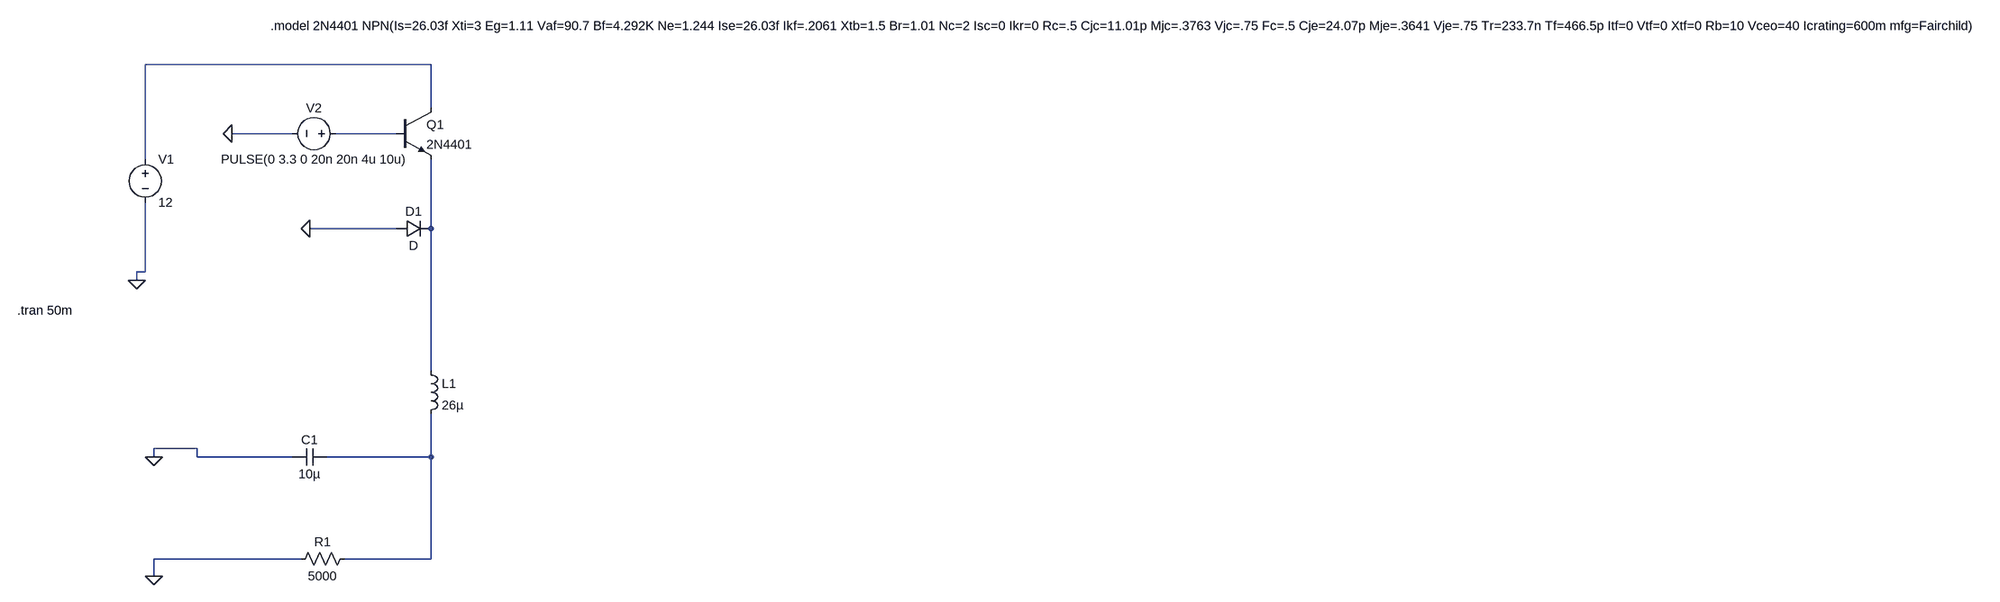
[diagram p0: schematic Buck convertor 12v to 2_2.asc]
Buck convertor 12v to 2_2.asc, the LTspice schematic file:
Version 4
SHEET 1 3708 1124
WIRE 480 144 -48 144
WIRE 480 224 480 144
WIRE 224 272 112 272
WIRE 416 272 304 272
WIRE -48 320 -48 144
WIRE 416 448 256 448
WIRE 480 448 480 320
WIRE -48 528 -48 400
WIRE -48 528 -64 528
WIRE -64 544 -64 528
WIRE 480 720 480 448
WIRE 48 864 -32 864
WIRE -32 880 -32 864
WIRE 48 880 48 864
WIRE 224 880 48 880
WIRE 480 880 480 800
WIRE 480 880 288 880
WIRE 240 1072 -32 1072
WIRE 480 1072 480 880
WIRE 480 1072 320 1072
WIRE -32 1104 -32 1072
FLAG 256 448 0
FLAG -64 544 0
FLAG -32 880 0
FLAG -32 1104 0
FLAG 112 272 0
SYMBOL npn 416 224 R0
SYMATTR InstName Q1
SYMATTR Value 2N4401
SYMBOL voltage -48 304 R0
SYMATTR InstName V1
SYMATTR Value 12
SYMBOL diode 416 464 R270
WINDOW 0 32 32 VTop 2
WINDOW 3 0 32 VBottom 2
SYMATTR InstName D1
SYMBOL ind 464 704 R0
SYMATTR InstName L1
SYMATTR Value 26µ
SYMBOL cap 288 864 R90
WINDOW 0 0 32 VBottom 2
WINDOW 3 32 32 VTop 2
SYMATTR InstName C1
SYMATTR Value 10µ
SYMBOL res 336 1056 R90
WINDOW 0 0 56 VBottom 2
WINDOW 3 32 56 VTop 2
SYMATTR InstName R1
SYMATTR Value 5000
SYMBOL voltage 320 272 R90
WINDOW 0 -32 56 VBottom 2
WINDOW 3 32 56 VTop 2
WINDOW 123 0 0 Left 0
WINDOW 39 0 0 Left 0
SYMATTR InstName V2
SYMATTR Value PULSE(0 3.3 0 20n 20n 4u 10u)
TEXT 184 72 Left 2 !.model 2N4401 NPN(Is=26.03f Xti=3 Eg=1.11 Vaf=90.7 Bf=4.292K Ne=1.244 Ise=26.03f Ikf=.2061 Xtb=1.5 Br=1.01 Nc=2 Isc=0 Ikr=0 Rc=.5 Cjc=11.01p Mjc=.3763 Vjc=.75 Fc=.5 Cje=24.07p Mje=.3641 Vje=.75 Tr=233.7n Tf=466.5p Itf=0 Vtf=0 Xtf=0 Rb=10 Vceo=40 Icrating=600m mfg=Fairchild)
TEXT -808 600 Left 2 !.tran 50m

The netlist it stands for:
* Buck convertor 12v to 2_2.asc
Q1 N001 N002 N003 0 2N4401
V1 N001 0 12
D1 0 N003 D
L1 N003 N004 26µ
C1 N004 0 10µ
R1 N004 0 5000
V2 N002 0 PULSE(0 3.3 0 20n 20n 4u 10u)
.model D D
.lib standard.dio
.model NPN NPN
.model PNP PNP
.lib standard.bjt
.model 2N4401 NPN(Is=26.03f Xti=3 Eg=1.11 Vaf=90.7 Bf=4.292K Ne=1.244 Ise=26.03f Ikf=.2061 Xtb=1.5 Br=1.01 Nc=2 Isc=0 Ikr=0 Rc=.5 Cjc=11.01p Mjc=.3763 Vjc=.75 Fc=.5 Cje=24.07p Mje=.3641 Vje=.75 Tr=233.7n Tf=466.5p Itf=0 Vtf=0 Xtf=0 Rb=10 Vceo=40 Icrating=600m mfg=Fairchild)
.tran 50m
.backanno
.end